# EAGLE design QC_MICRO_v0_1_without_teardrop (EAGLE 5.10)
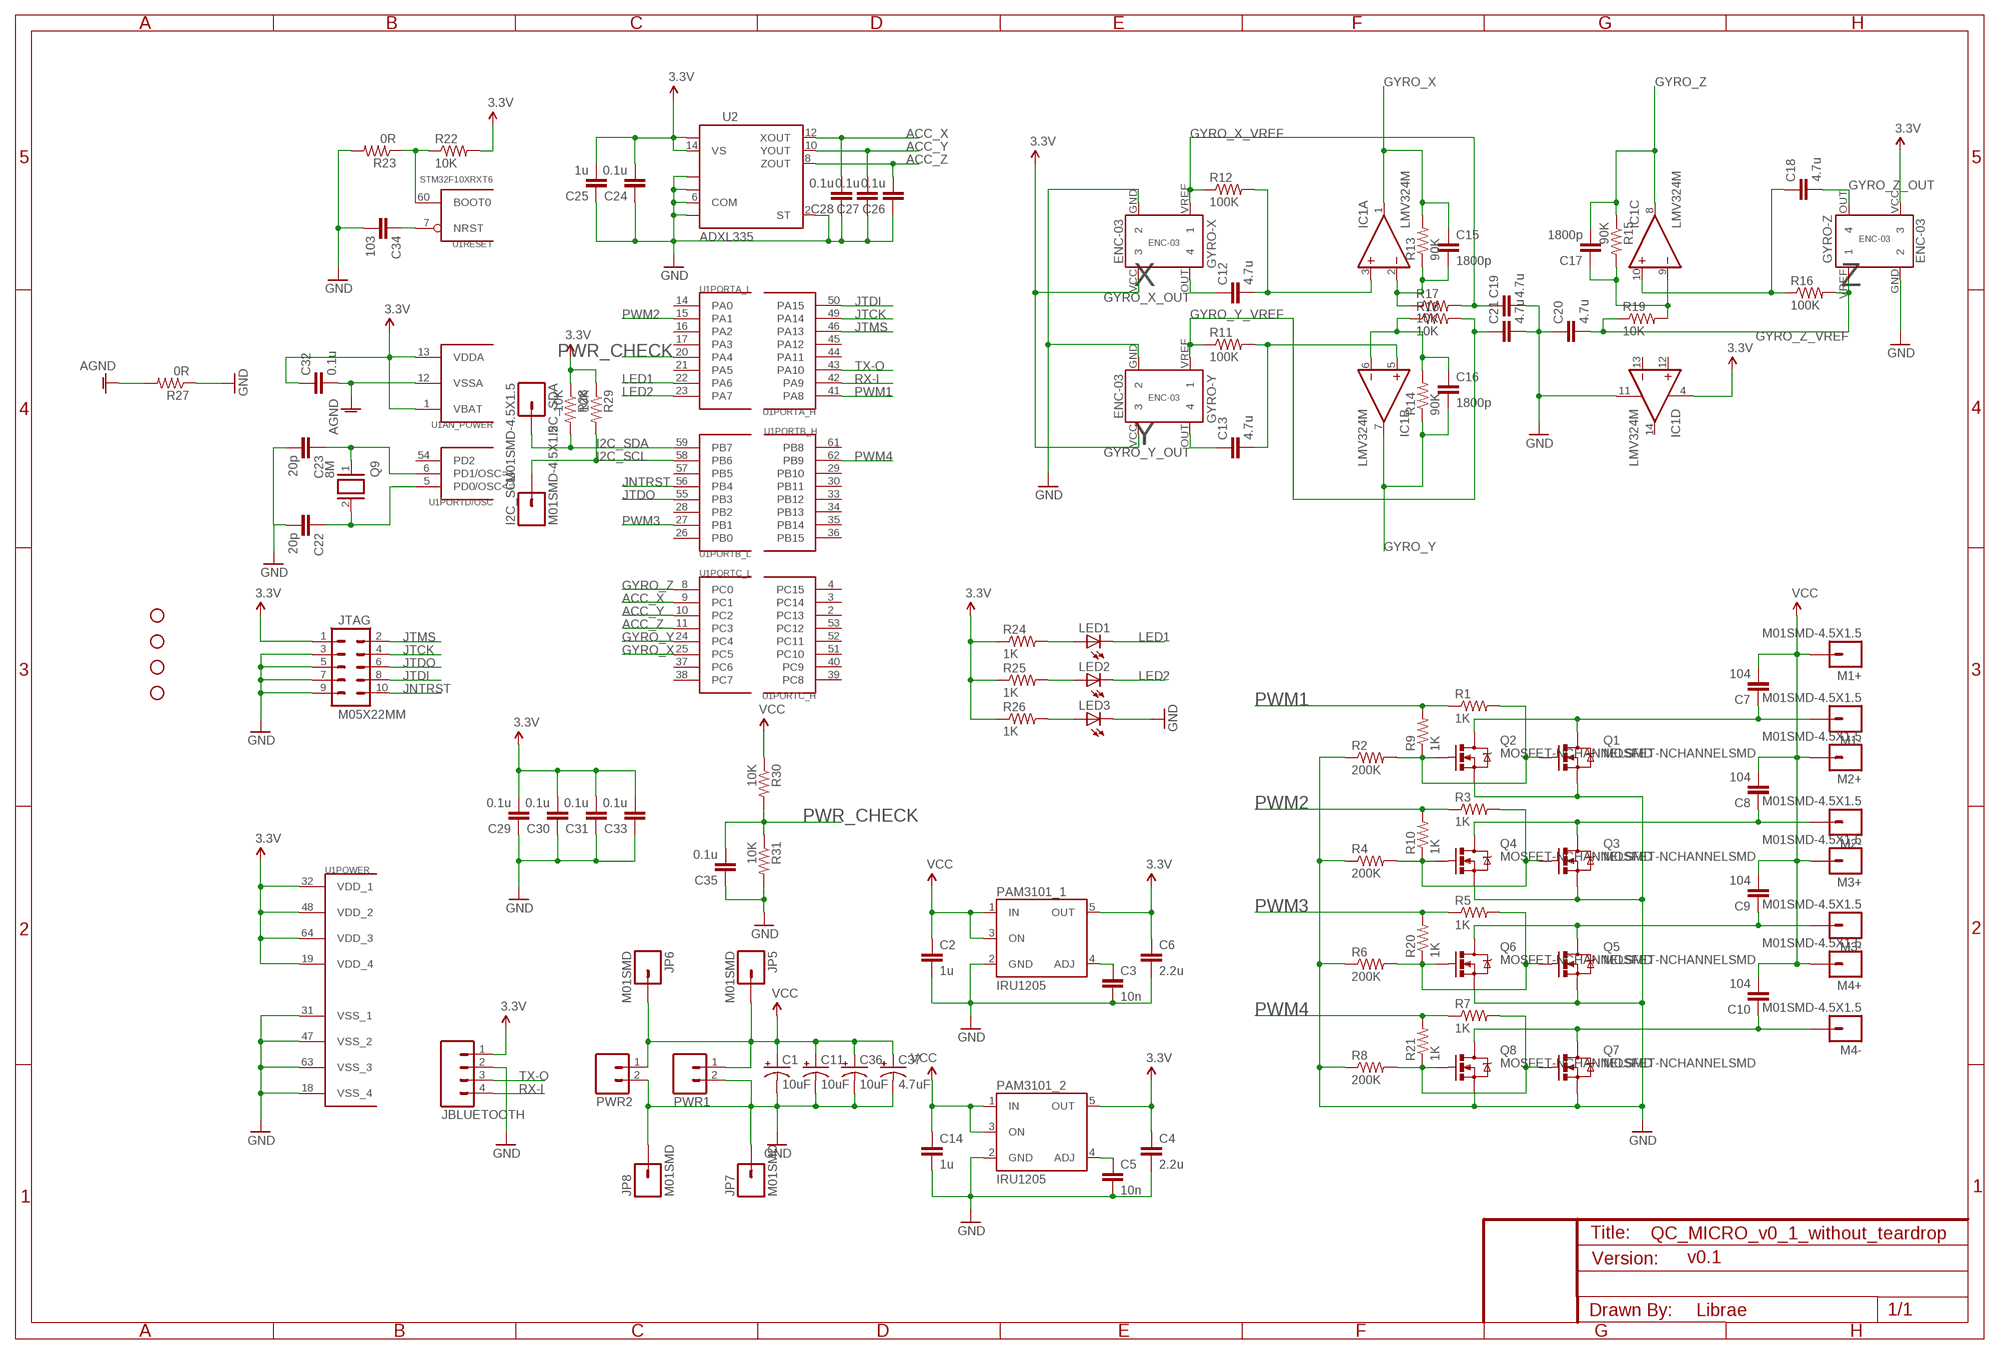
[diagram p0: schematic, sheet 1]

## Parts
C1  10uF  CAP_POL3528  [EIA3528]
C2  1u  CAP0603-CAP  [0603-CAP]
C3  10n  CAP0603-CAP  [0603-CAP]
C4  2.2u  CAP0603-CAP  [0603-CAP]
C5  10n  CAP0603-CAP  [0603-CAP]
C6  2.2u  CAP0603-CAP  [0603-CAP]
C7  104  CAP0603-CAP  [0603-CAP]
C8  104  CAP0603-CAP  [0603-CAP]
C9  104  CAP0603-CAP  [0603-CAP]
C10  104  CAP0603-CAP  [0603-CAP]
C11  10uF  CAP_POL3528  [EIA3528]
C12  4.7u  CAP0603-CAP  [0603-CAP]
C13  4.7u  CAP0603-CAP  [0603-CAP]
C14  1u  CAP0603-CAP  [0603-CAP]
C15  1800p  CAP0603-CAP  [0603-CAP]
C16  1800p  CAP0603-CAP  [0603-CAP]
C17  1800p  CAP0603-CAP  [0603-CAP]
C18  4.7u  CAP0603-CAP  [0603-CAP]
C19  4.7u  CAP0603-CAP  [0603-CAP]
C20  4.7u  CAP0603-CAP  [0603-CAP]
C21  4.7u  CAP0603-CAP  [0603-CAP]
C22  20p  CAP0603-CAP  [0603-CAP]
C23  20p  CAP0603-CAP  [0603-CAP]
C24  0.1u  CAP0603-CAP  [0603-CAP]
C25  1u  CAP0603-CAP  [0603-CAP]
C26  0.1u  CAP0603-CAP  [0603-CAP]
C27  0.1u  CAP0603-CAP  [0603-CAP]
C28  0.1u  CAP0603-CAP  [0603-CAP]
C29  0.1u  CAP0603-CAP  [0603-CAP]
C30  0.1u  CAP0603-CAP  [0603-CAP]
C31  0.1u  CAP0603-CAP  [0603-CAP]
C32  0.1u  CAP0603-CAP  [0603-CAP]
C33  0.1u  CAP0603-CAP  [0603-CAP]
C34  103  CAP0603-CAP  [0603-CAP]
C35  0.1u  CAP0603-CAP  [0603-CAP]
C36  10uF  CAP_POL3528  [EIA3528]
C37  4.7uF  CAP_POL1206  [EIA3216]
GYRO-X  ENC-03S  [ENC-03]
GYRO-Y  ENC-03S  [ENC-03]
GYRO-Z  ENC-03S  [ENC-03]
I2C_SCL  M01SMD-4.5X1.5  [PAD-1.5X4.5]
I2C_SDA  M01SMD-4.5X1.5  [PAD-1.5X4.5]
IC1  LMV324M  [SO14]
JBLUETOOTH  M04SMD  [1X04-SMD]
JP1  STAND-OFF  [STAND-OFF]
JP2  STAND-OFF  [STAND-OFF]
JP3  STAND-OFF  [STAND-OFF]
JP4  STAND-OFF  [STAND-OFF]
JP5  M01SMD  [LUXEON-PAD]
JP6  M01SMD  [LUXEON-PAD]
JP7  M01SMD  [LUXEON-PAD]
JP8  M01SMD  [LUXEON-PAD]
JTAG  M05X22MM  [1X10-2MM]
LED1  LED0603  [LED-0603]
LED2  LED0603  [LED-0603]
LED3  LED0603  [LED-0603]
M1+  M01SMD-4.5X1.5  [PAD-1.5X4.5]
M1-  M01SMD-4.5X1.5  [PAD-1.5X4.5]
M2+  M01SMD-4.5X1.5  [PAD-1.5X4.5]
M2-  M01SMD-4.5X1.5  [PAD-1.5X4.5]
M3+  M01SMD-4.5X1.5  [PAD-1.5X4.5]
M3-  M01SMD-4.5X1.5  [PAD-1.5X4.5]
M4+  M01SMD-4.5X1.5  [PAD-1.5X4.5]
M4-  M01SMD-4.5X1.5  [PAD-1.5X4.5]
PAM3101_1  IRU1205  [SOT23-5]
PAM3101_2  IRU1205  [SOT23-5]
PWR1  M023.5MM  [SCREWTERMINAL-3.5MM-2]
PWR2  M023.5MM  [SCREWTERMINAL-3.5MM-2]
Q1  MOSFET-NCHANNELSMD  [SOT23-3]
Q2  MOSFET-NCHANNELSMD  [SOT23-3]
Q3  MOSFET-NCHANNELSMD  [SOT23-3]
Q4  MOSFET-NCHANNELSMD  [SOT23-3]
Q5  MOSFET-NCHANNELSMD  [SOT23-3]
Q6  MOSFET-NCHANNELSMD  [SOT23-3]
Q7  MOSFET-NCHANNELSMD  [SOT23-3]
Q8  MOSFET-NCHANNELSMD  [SOT23-3]
Q9  8M  XTAL/S  [QS]
R1  1K  RESISTOR0603-RES  [0603-RES]
R2  200K  RESISTOR0603-RES  [0603-RES]
R3  1K  RESISTOR0603-RES  [0603-RES]
R4  200K  RESISTOR0603-RES  [0603-RES]
R5  1K  RESISTOR0603-RES  [0603-RES]
R6  200K  RESISTOR0603-RES  [0603-RES]
R7  1K  RESISTOR0603-RES  [0603-RES]
R8  200K  RESISTOR0603-RES  [0603-RES]
R9  1K  RESISTOR0603-RES  [0603-RES]
R10  1K  RESISTOR0603-RES  [0603-RES]
R11  100K  RESISTOR0603-RES  [0603-RES]
R12  100K  RESISTOR0603-RES  [0603-RES]
R13  90K  RESISTOR0603-RES  [0603-RES]
R14  90K  RESISTOR0603-RES  [0603-RES]
R15  90K  RESISTOR0603-RES  [0603-RES]
R16  100K  RESISTOR0603-RES  [0603-RES]
R17  10K  RESISTOR0603-RES  [0603-RES]
R18  10K  RESISTOR0603-RES  [0603-RES]
R19  10K  RESISTOR0603-RES  [0603-RES]
R20  1K  RESISTOR0603-RES  [0603-RES]
R21  1K  RESISTOR0603-RES  [0603-RES]
R22  10K  RESISTOR0603-RES  [0603-RES]
R23  0R  RESISTOR0603-RES  [0603-RES]
R24  1K  RESISTOR0603-RES  [0603-RES]
R25  1K  RESISTOR0603-RES  [0603-RES]
R26  1K  RESISTOR0603-RES  [0603-RES]
R27  0R  RESISTOR0603-RES  [0603-RES]
R28  10K  RESISTOR0603-RES  [0603-RES]
R29  10K  RESISTOR0603-RES  [0603-RES]
R30  10K  RESISTOR0603-RES  [0603-RES]
R31  10K  RESISTOR0603-RES  [0603-RES]
U1  STM32F10XRXT6  [TQFP64]
U2  ADXL335  [LFCSP-16]

## Nets
3.3V: C4.1 C6.1 C24.2 C25.2 C29.2 C30.2 C31.2 C32.1 C33.2 GYRO-X.VCC GYRO-Y.VCC GYRO-Z.VCC IC1.4(P:V+) JBLUETOOTH.1 JTAG.1 PAM3101_1.5(OUT) PAM3101_2.5(OUT) R22.2 R24.1 R25.1 R26.1 R28.1 R29.1 U1.1(AN_POWER:VBAT) U1.13(AN_POWER:VDDA) U1.19(POWER:VDD_4) U1.32(POWER:VDD_1) U1.48(POWER:VDD_2) U1.64(POWER:VDD_3) U2.14(VS) U2.15(VS)
ACC_X: C28.2 U1.9(PORTC_L:PC1) U2.12(XOUT)
ACC_Y: C27.2 U1.10(PORTC_L:PC2) U2.10(YOUT)
ACC_Z: C26.2 U1.11(PORTC_L:PC3) U2.8(ZOUT)
AGND: C32.2 R27.2 U1.12(AN_POWER:VSSA)
GND: C1.C(-) C2.2 C3.2 C4.2 C5.2 C6.2 C11.C(-) C14.2 C19.2 C20.1 C21.2 C22.2 C23.2 C24.1 C25.1 C26.1 C27.1 C28.1 C29.1 C30.1 C31.1 C33.1 C34.2 C35.1 C36.C(-) C37.C(-) GYRO-X.GND GYRO-Y.GND GYRO-Z.GND IC1.11(P:V-) JBLUETOOTH.2 JP7.P$1 JP8.P$1 JTAG.3 JTAG.5 JTAG.7 JTAG.9 LED3.C PAM3101_1.2(GND) PAM3101_2.2(GND) PWR1.2 PWR2.2 Q1.2(S) Q2.2(S) Q3.2(S) Q4.2(S) Q5.2(S) Q6.2(S) Q7.2(S) Q8.2(S) R2.1 R4.1 R6.1 R8.1 R23.2 R27.1 R31.2 U1.18(POWER:VSS_4) U1.31(POWER:VSS_1) U1.47(POWER:VSS_2) U1.63(POWER:VSS_3) U2.2(ST) U2.3(COM) U2.5(COM) U2.6(COM) U2.7(COM)
GYRO_X: C15.1 IC1.1(A:OUT) R13.2 U1.25(PORTC_L:PC5)
GYRO_X_OUT: C12.1 GYRO-X.OUT
GYRO_X_VREF: C19.1 GYRO-X.VREF R12.1 R17.2
GYRO_Y: C16.2 IC1.7(B:OUT) R14.1 U1.24(PORTC_L:PC4)
GYRO_Y_OUT: C13.1 GYRO-Y.OUT
GYRO_Y_VREF: C21.1 GYRO-Y.VREF R11.1 R18.2
GYRO_Z: C17.2 IC1.8(C:OUT) R15.1 U1.8(PORTC_L:PC0)
GYRO_Z_OUT: C18.2 GYRO-Z.OUT
GYRO_Z_VREF: C20.2 GYRO-Z.VREF R16.2 R19.1
I2C_SCL: I2C_SCL.P$1 R29.2 U1.58(PORTB_L:PB6)
I2C_SDA: I2C_SDA.P$1 R28.2 U1.59(PORTB_L:PB7)
JNTRST: JTAG.10 U1.56(PORTB_L:PB4)
JTCK: JTAG.4 U1.49(PORTA_H:PA14)
JTDI: JTAG.8 U1.50(PORTA_H:PA15)
JTDO: JTAG.6 U1.55(PORTB_L:PB3)
JTMS: JTAG.2 U1.46(PORTA_H:PA13)
LED1: LED1.C U1.22(PORTA_L:PA6)
LED2: LED2.C U1.23(PORTA_L:PA7)
N$1: C7.1 M1-.P$1 Q1.3(D) Q2.3(D)
N$2: C8.1 M2-.P$1 Q3.3(D) Q4.3(D)
N$3: C9.1 M3-.P$1 Q5.3(D) Q6.3(D)
N$4: C10.1 M4-.P$1 Q7.3(D) Q8.3(D)
N$5: Q3.1(G) Q4.1(G) R3.2 R4.2 R10.1
N$6: Q5.1(G) Q6.1(G) R5.2 R6.2 R20.1
N$7: Q7.1(G) Q8.1(G) R7.2 R8.2 R21.1
N$8: Q1.1(G) Q2.1(G) R1.2 R2.2 R9.1
N$9: C3.1 PAM3101_1.4(ADJ)
N$10: C23.1 Q9.1 U1.6(PORTD/OSC:PD1/OSC=>)
N$11: C34.1 U1.7(RESET:NRST)
N$12: R22.1 R23.1 U1.60(RESET:BOOT0)
N$13: LED1.A R24.2
N$14: C5.1 PAM3101_2.4(ADJ)
N$15: C22.1 Q9.2 U1.5(PORTD/OSC:PD0/OSC<=)
N$16: LED2.A R25.2
N$17: LED3.A R26.2
N$18: C13.2 IC1.5(B:+IN) R11.2
N$19: C12.2 IC1.3(A:+IN) R12.2
N$21: C15.2 IC1.2(A:-IN) R13.1 R17.1
N$22: C16.1 IC1.6(B:-IN) R14.2 R18.1
N$24: C17.1 IC1.9(C:-IN) R15.2 R19.2
N$30: C18.1 IC1.10(C:+IN) R16.1
PWM1: R1.1 R9.2 U1.41(PORTA_H:PA8)
PWM2: R3.1 R10.2 U1.15(PORTA_L:PA1)
PWM3: R5.1 R20.2 U1.27(PORTB_L:PB1)
PWM4: R7.1 R21.2 U1.62(PORTB_H:PB9)
PWR_CHECK: C35.2 R30.2 R31.1 U1.20(PORTA_L:PA4)
RX-I: JBLUETOOTH.4 U1.42(PORTA_H:PA9)
TX-O: JBLUETOOTH.3 U1.43(PORTA_H:PA10)
VCC: C1.A(+) C2.1 C7.2 C8.2 C9.2 C10.2 C11.A(+) C14.1 C36.A(+) C37.A(+) JP5.P$1 JP6.P$1 M1+.P$1 M2+.P$1 M3+.P$1 M4+.P$1 PAM3101_1.1(IN) PAM3101_1.3(ON) PAM3101_2.1(IN) PAM3101_2.3(ON) PWR1.1 PWR2.1 R30.1
Unconnected: IC1.12(D:+IN) IC1.13(D:-IN) IC1.14(D:OUT) U1.2(PORTC_H:PC13) U1.3(PORTC_H:PC14) U1.4(PORTC_H:PC15) U1.14(PORTA_L:PA0) U1.16(PORTA_L:PA2) U1.17(PORTA_L:PA3) U1.21(PORTA_L:PA5) U1.26(PORTB_L:PB0) U1.28(PORTB_L:PB2) U1.29(PORTB_H:PB10) U1.30(PORTB_H:PB11) U1.33(PORTB_H:PB12) U1.34(PORTB_H:PB13) U1.35(PORTB_H:PB14) U1.36(PORTB_H:PB15) U1.37(PORTC_L:PC6) U1.38(PORTC_L:PC7) U1.39(PORTC_H:PC8) U1.40(PORTC_H:PC9) U1.44(PORTA_H:PA11) U1.45(PORTA_H:PA12) U1.51(PORTC_H:PC10) U1.52(PORTC_H:PC11) U1.53(PORTC_H:PC12) U1.54(PORTD/OSC:PD2) U1.57(PORTB_L:PB5) U1.61(PORTB_H:PB8)

## Notes on the sheet
- X | Z
- Y
- v0.1
- Librae

## Library data of the parts
C1 C11 C36 C37 = SparkFun:CAP_POL: Capacitor Polarized These are standard SMD and PTH capacitors. Normally 10uF, 47uF, and 100uF in electrolytic and tantalum varieties. Always verify the external diameter of the through hole cap, it varies with capacity, voltage, and manufacturer. The EIA devices should be standard.
C2-C10 C12-C35 = SparkFun:CAP: Capacitor Standard 0603 ceramic capacitor, and 0.1" leaded capacitor.
GYRO-X GYRO-Y GYRO-Z = ENC-03R:ENC-03: ENC-03<2>
I2C_SCL I2C_SDA JP5-JP8 M1+ M1- M2+ M2- M3+ M3- M4+ M4- = SparkFun:M01: Header 1 Standard 1-pin 0.1" header. Use with straight break away headers (SKU : PRT-00116), right angle break away headers (PRT-00553), swiss pins (PRT-00743), machine pins (PRT-00117), and female headers (PRT-00115).
IC1 = linear:LMV324?*: Quad General Purpose, Low Voltage, Rail-to-Rail Output Operational Amplifiers Source: http://www.national.com/mpf/LM/LMV321.html http://www.national.com/dt/lmv_qual.pdf
JBLUETOOTH = MyLib:M04: Header 4 Standard 4-pin 0.1" header. Use with straight break away headers (SKU : PRT-00116), right angle break away headers (PRT-00553), swiss pins (PRT-00743), machine pins (PRT-00117), and female headers (PRT-00115). Molex polarized connector foot print use with SKU : PRT-08231 with associated crimp pins and housings.
JP1-JP4 = SparkFun:STAND-OFF: Stand Off This is the mechanical footprint for a #4 phillips button head screw. Use the keepout ring to avoid running the screw head into surrounding components. SKU : PRT-00447
JTAG = MyLib:M05X2: Header 5x2 Standard 10-pin dual row 0.1" header. Commonly used with AVR-ISP. Use with Spark Fun Electronics SKU: PRT-00778
LED1-LED3 = SparkFun:LED: LEDs Standard schematic elements and footprints for 5mm, 3mm, 1206, and 0603 sized LEDs. 5mm - Spark Fun Electronics SKU : COM-00529 (and others)
PAM3101_1 PAM3101_2 = v-reg-3:IRU1205: Ultra low dropout positive regulator, 300mA, enable input
PWR1 PWR2 = SparkFun:M02: Header 2 Standard 2-pin 0.1" header. Use with straight break away headers (SKU : PRT-00116), right angle break away headers (PRT-00553), swiss pins (PRT-00743), machine pins (PRT-00117), and female headers (PRT-00115). Molex polarized connector foot print use with SKU : PRT-08233 with associated crimp pins and housings.
Q1-Q8 = SparkFun:MOSFET-NCHANNEL
Q9 = special:XTAL/S: CRYSTAL
R1-R31 = SparkFun:RESISTOR: Resistor Basic schematic elements and footprints for 0603, 1206, and PTH 1/10th watt (small) resistors.
U1 = stm32:STM32F10XRXT6: STM32F101/103 64pin LQFP
U2 = SparkFun:ADXL335

## Board
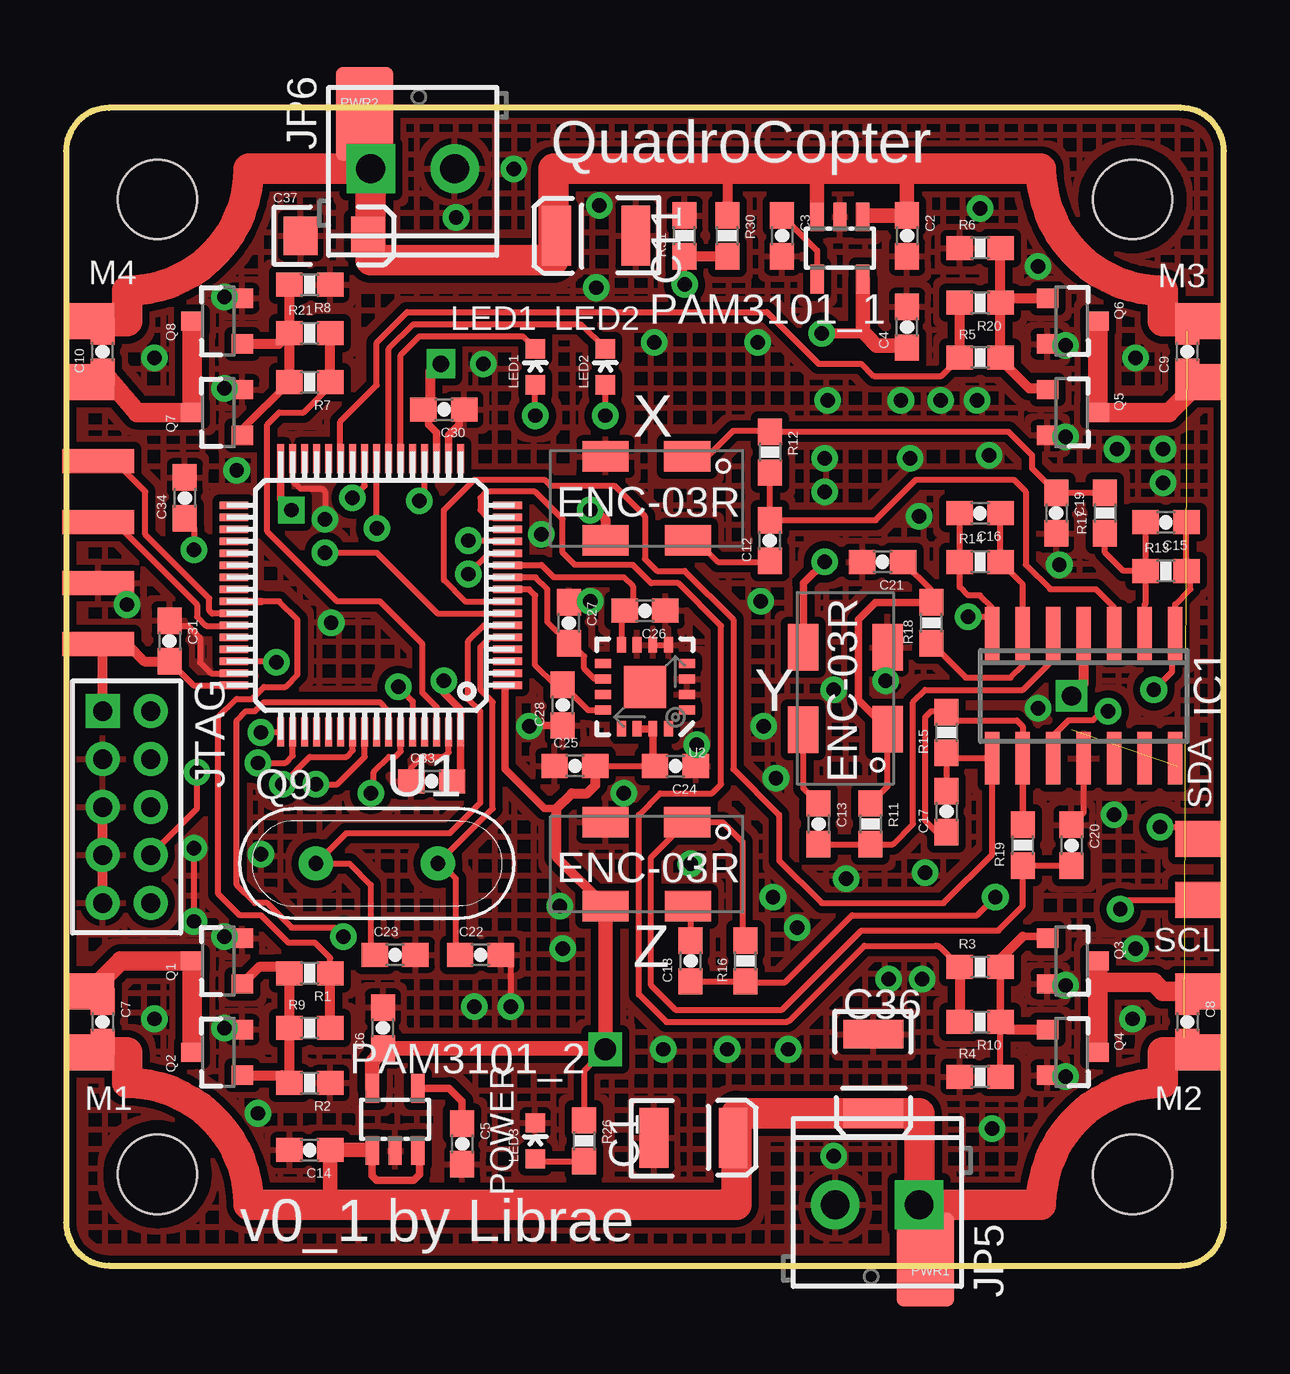
[diagram p1: board, top side]
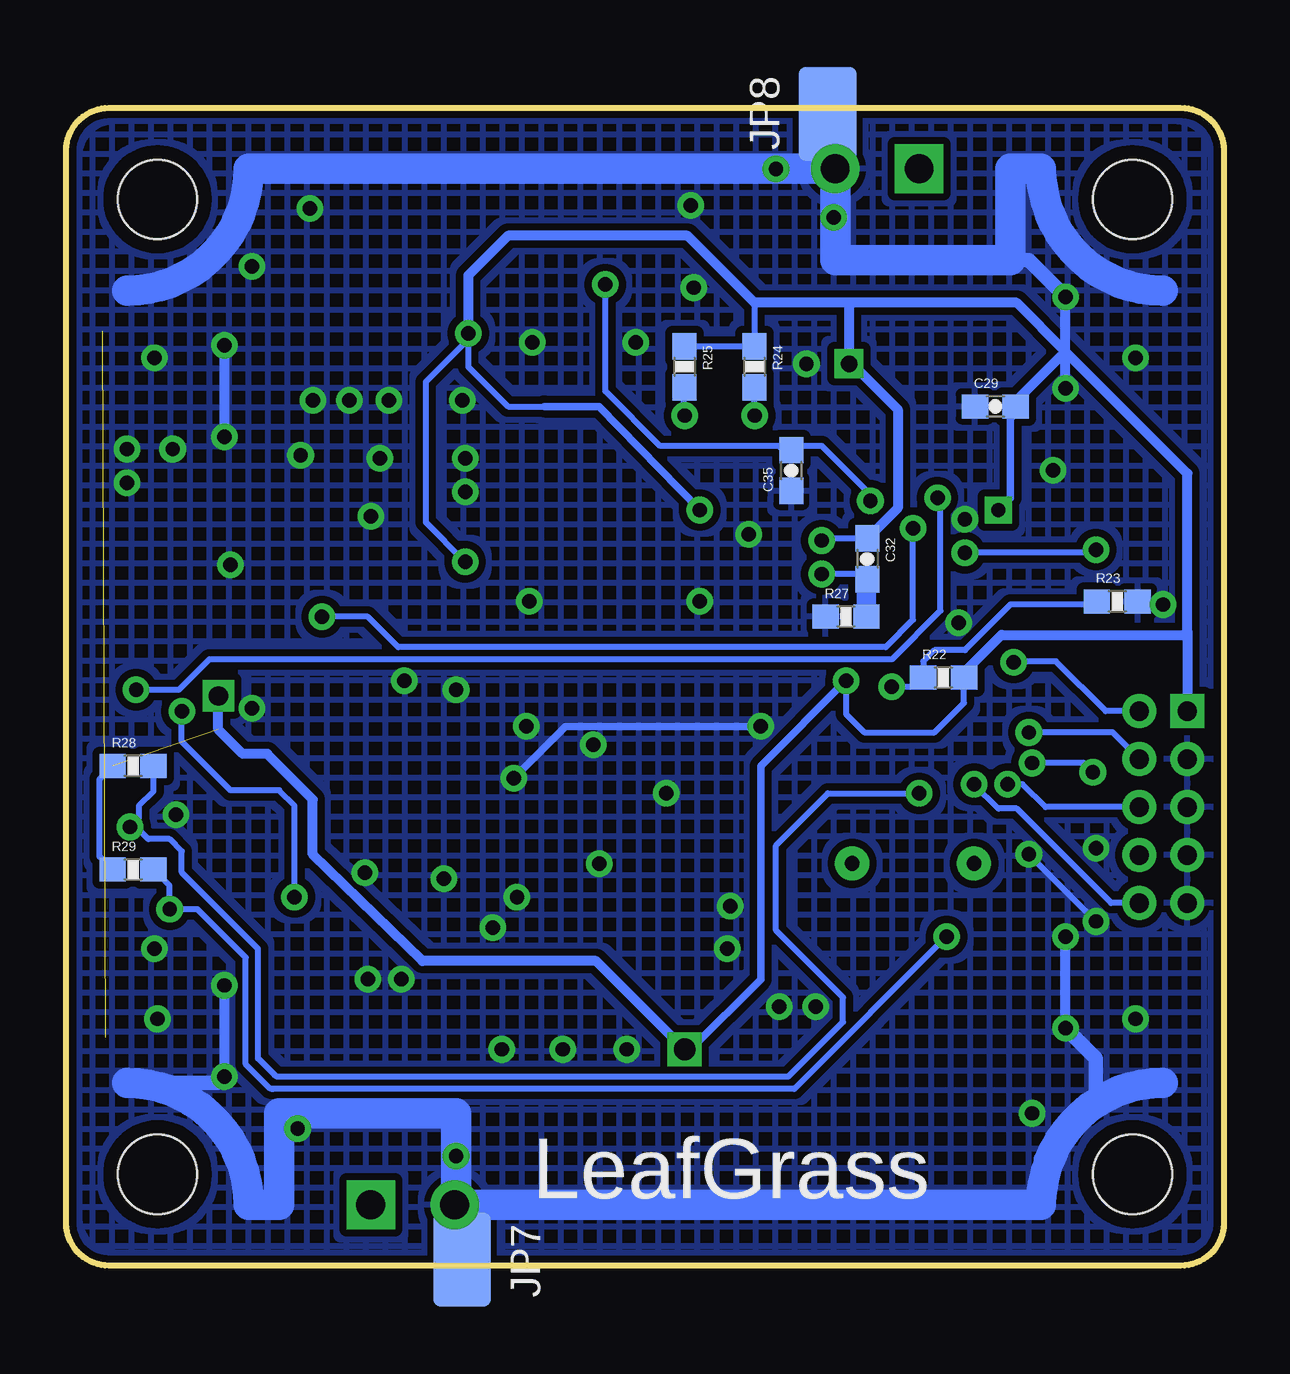
[diagram p2: board, bottom side, seen from below]

Size 48.26 x 48.26 mm. Coordinates in mm from the lower left corner, seen from the top.
Outline: 48.26,46.46 arc90 46.46,48.26 1.8,48.26 arc90 0,46.46 0,1.8 arc90 1.8,0 46.46,0 arc90 48.26,1.8 48.26,46.46
Copper layers (1*16): Top 0.035mm / dielectric 1.5mm / Bottom 0.035mm
Design rules "SparkFun": minimum track width 8mil, minimum drill 20mil, track to track 8mil, track to pad 8mil, pad to pad 8mil, via to via 8mil, smd to smd 8mil, copper to edge 10mil, drill to drill 8mil, minimum pad ring 12mil, minimum via ring 10mil, stop-mask expansion 4mil, vias tented up to drill 25mil, thermal gap 10mil

### Footprints (pad centres in the part's own frame; a part is rotated, then mirrored left to right if it is on the bottom)
EIA3528 = smd 1.2 x 2.5: A 1.65,0; C -1.65,0
0603-CAP = smd 1.1 x 1: 1 -0.85,0; 2 0.85,0
EIA3216 = smd 1.4 x 1.6: A 1.4,0; C -1.4,0
ENC-03 = smd 1.93 x 1.27: GND 1.645,-1.984; OUT -1.791,1.525; VCC 1.645,1.525; VREF -1.765,-1.98
PAD-1.5X4.5 = smd 1.5 x 2: P$1 0,0
SO14 = smd 0.6 x 2.2: 1 -3.81,-2.6; 2 -2.54,-2.6; 3 -1.27,-2.6; 4 0,-2.6; 5 1.27,-2.6; 6 2.54,-2.6; 7 3.81,-2.6; 8 3.81,2.6; 9 2.54,2.6; 10 1.27,2.6; 11 0,2.6; 12 -1.27,2.6; 13 -2.54,2.6; 14 -3.81,2.6
1X04-SMD = smd 1 x 3: 1 -3.81,-0.08; 2 -1.27,-0.08; 3 1.27,-0.08; 4 3.81,-0.08
STAND-OFF = hole 3.302: 0,0
LUXEON-PAD = smd 3.9 x 2.4: P$1 0,0
1X10-2MM = drill 0.8 square: 1 0,0 | drill 0.8 round: 2 0,2; 3 2,0; 4 2,2; 5 4,0; 6 4,2; 7 6,0; 8 6,2; 9 8,0; 10 8,2
LED-0603 = smd 0.8 x 0.8: A 0,-0.75; C 0,0.75
SOT23-5 = smd 0.55 x 1.2: 1 -0.95,-1.3; 2 0,-1.3; 3 0.95,-1.3; 4 0.95,1.3; 5 -0.95,1.3
SCREWTERMINAL-3.5MM-2 = drill 1.2 pad 2.032 square: 1 0,0 | drill 1.2 pad 2.032 round: 2 3.5,0
SOT23-3 = smd 0.8 x 0.9: 1 -0.95,-1; 2 0.95,-1; 3 0,1.1
QS = drill 0.61 pad 1.422 round: 1 -2.54,0; 2 2.54,0
0603-RES = smd 1.1 x 1: 1 -0.85,0; 2 0.85,0
TQFP64 = smd 1.2 x 0.3: 1 -5.7,3.75; 2 -5.7,3.25; 3 -5.7,2.75; 4 -5.7,2.25; 5 -5.7,1.75; 6 -5.7,1.25; 7 -5.7,0.75; 8 -5.7,0.25; 9 -5.7,-0.25; 10 -5.7,-0.75; 11 -5.7,-1.25; 12 -5.7,-1.75; 13 -5.7,-2.25; 14 -5.7,-2.75; 15 -5.7,-3.25; 16 -5.7,-3.75; 33 5.7,-3.75; 34 5.7,-3.25; 35 5.7,-2.75; 36 5.7,-2.25; 37 5.7,-1.75; 38 5.7,-1.25; 39 5.7,-0.75; 40 5.7,-0.25; 41 5.7,0.25; 42 5.7,0.75; 43 5.7,1.25; 44 5.7,1.75; 45 5.7,2.25; 46 5.7,2.75; 47 5.7,3.25; 48 5.7,3.75 | smd 0.3 x 1.2: 17 -3.75,-5.7; 18 -3.25,-5.7; 19 -2.75,-5.7; 20 -2.25,-5.7; 21 -1.75,-5.7; 22 -1.25,-5.7; 23 -0.75,-5.7; 24 -0.25,-5.7; 25 0.25,-5.7; 26 0.75,-5.7; 27 1.25,-5.7; 28 1.75,-5.7; 29 2.25,-5.7; 30 2.75,-5.7; 31 3.25,-5.7; 32 3.75,-5.7; 49 3.75,5.7; 50 3.25,5.7; 51 2.75,5.7; 52 2.25,5.7; 53 1.75,5.7; 54 1.25,5.7; 55 0.75,5.7; 56 0.25,5.7; 57 -0.25,5.7; 58 -0.75,5.7; 59 -1.25,5.7; 60 -1.75,5.7; 61 -2.25,5.7; 62 -2.75,5.7; 63 -3.25,5.7; 64 -3.75,5.7
LFCSP-16 = smd 1.75 x 1.75: 0 0,0 | smd 0.65 x 0.37: 1 -1.75,0.975; 2 -1.75,0.325; 3 -1.75,-0.325; 4 -1.75,-0.975; 9 1.75,-0.975; 10 1.75,-0.325; 11 1.75,0.325; 12 1.75,0.975 | smd 0.37 x 0.65: 5 -0.975,-1.75; 6 -0.325,-1.75; 7 0.325,-1.75; 8 0.975,-1.75; 13 0.975,1.75; 14 0.325,1.75; 15 -0.325,1.75; 16 -0.975,1.75

### Placement (x,y rotation side)
C1  26.16,5.33 0 top
C2  35.05,42.93 270 top
C3  29.84,42.93 270 top
C4  35.05,39.12 90 top
C5  16.51,5.08 270 top
C6  13.21,9.91 90 top
C7  1.52,10.16 270 top
C8  46.74,10.16 270 top
C9  46.74,38.1 90 top
C10  1.52,38.1 90 top
C11  22.1,42.93 180 top
C12  29.34,30.23 90 top
C13  31.37,18.41 270 top
C14  10.16,4.83 180 top
C15  45.85,30.99 180 top
C16  38.1,31.37 180 top
C17  36.7,18.92 90 top
C18  26.04,12.7 90 top
C19  41.27,31.37 270 top
C20  41.91,17.53 270 top
C21  34.04,29.34 180 top
C22  17.27,12.95 0 top
C23  13.72,12.95 0 top
C24  25.4,20.83 180 top
C25  21.21,20.83 0 top
C26  24.13,27.3 180 top
C27  20.95,26.8 270 top
C28  20.7,23.37 90 top
C29  9.53,35.81 0 bottom
C30  15.75,35.69 180 top
C31  4.32,26.04 270 top
C32  14.86,29.46 270 bottom
C33  15.24,20.19 0 top
C34  4.95,32 90 top
C35  18.03,33.15 90 bottom
C36  33.66,8 270 top
C37  11.18,42.93 0 top
GYRO-X  24.13,31.75 180 top
GYRO-Y  32.26,24.13 90 top
GYRO-Z  24.13,16.51 180 top
I2C_SCL  47.24,15.24 90 top
I2C_SDA  47.24,17.78 90 top
IC1  42.42,23.75 180 top
JBLUETOOTH  1.27,29.72 90 top
JP1  3.81,3.81 0 top
JP2  44.45,3.81 0 top
JP3  44.45,44.45 0 top
JP4  3.81,44.45 0 top
JP5  35.81,0.25 270 top
JP6  12.45,48.01 90 top
JP7  31.75,0.25 270 bottom
JP8  16.51,48.01 90 bottom
JTAG  1.52,23.11 270 top
LED1  19.56,37.47 0 top
LED2  22.48,37.47 0 top
LED3  19.56,5.21 0 top
M1+  1.02,8.89 90 top
M1-  1.02,11.43 90 top
M2+  47.24,8.89 90 top
M2-  47.24,11.43 90 top
M3+  47.24,39.37 90 top
M3-  47.24,36.83 90 top
M4+  1.02,39.37 90 top
M4-  1.02,36.83 270 top
PAM3101_1  32.26,42.42 180 top
PAM3101_2  13.72,6.1 0 top
PWR1  35.56,2.54 180 top
PWR2  12.7,45.72 0 top
Q1  6.35,12.7 90 top
Q2  6.35,8.89 90 top
Q3  41.91,12.7 270 top
Q4  41.91,8.89 270 top
Q5  41.91,35.56 270 top
Q6  41.91,39.37 270 top
Q7  6.35,35.56 90 top
Q8  6.35,39.37 90 top
Q9  12.95,16.76 0 top
R1  10.16,12.19 180 top
R2  10.16,7.62 180 top
R3  38.1,12.45 0 top
R4  38.1,7.87 0 top
R5  38.1,37.85 0 top
R6  38.1,42.42 0 top
R7  10.16,36.83 180 top
R8  10.16,40.89 180 top
R9  10.16,9.91 0 top
R10  38.1,10.16 180 top
R11  33.53,18.41 270 top
R12  29.34,33.91 270 top
R13  45.85,28.96 0 top
R14  38.1,29.34 0 top
R15  36.7,22.23 90 top
R16  28.32,12.7 90 top
R17  43.31,31.37 90 top
R18  36.07,26.8 90 top
R19  39.88,17.53 90 top
R20  38.1,40.13 180 top
R21  10.16,38.86 0 top
R22  11.68,24.51 0 bottom
R23  4.45,27.69 0 bottom
R24  19.56,37.47 270 bottom
R25  22.48,37.47 270 bottom
R26  21.59,5.21 270 top
R27  15.75,27.05 0 bottom
R28  45.47,20.83 0 bottom
R29  45.47,16.51 0 bottom
R30  27.56,42.93 270 top
R31  25.78,42.93 90 top
U1  12.7,27.94 180 top
U2  24.13,24.13 180 top

### Tracks (layer width: path | path; a pad name or v marks a point on that pad's centre or on a via)
3.3V  (via drill 0.6, 0.7, 0.8, 0.9)  (1 unrouted)
  Top 0.254: C25.2 C24.2 | C30.2 15.11,35.47 | U1.48 5.31,24.19 C31.2 | C33.2 16.45,20.19 U1.64 | R26.1 21.59,8.13 v22.48,9.02 | v16.76,30.23 18.36,30.23 U1.13
  Top 0.305: C24.2 24.45,20.92 U2.15 U2.14 | U1.19 15.45,34.72 15.11,35.05 15.11,35.47 | 22.44,9.06 v22.48,9.02 | 22.48,14.98 GYRO-Z.VCC | 20.45,19.05 19.94,19.05 18.29,20.7 18.29,24.08 U1.1 | 16.45,20.19 16.45,23.17 15.75,23.88 v15.75,24.38 | U1.32 8.95,31.94 v9.4,31.5 | GYRO-Y.VCC 30.73,28.45 v31.62,29.34 | 22.48,31.11 22.1,31.5 v21.84,31.5
  Top 0.406: v31.5,38.86 33.27,38.86 33.4,38.73 | JTAG.1 1.52,25.73 JBLUETOOTH.1 2.54,25.91 3.26,25.18 C31.2 | GYRO-Z.VCC 20.45,17.02 20.45,19.05 21.08,19.68 21.72,19.68 22.06,20.03 C25.2 | 22.48,31.11 GYRO-X.VCC | C30.2 15.18,35.97 15.18,37.27 15.49,37.59 v15.62,37.59 | IC1.4 42.42,24.26 v41.91,23.75
  Top 0.61: PAM3101_2.5 12.77,8.48 C6.1 22.44,9.06 | PAM3101_1.5 33.21,38.93 33.4,38.73 33.78,38.35 34.96,38.35 C4.1 | v22.48,9.02 22.48,14.98
  Bottom 0.254: R22.2 10.83,23.46 12.06,22.23 14.99,22.23 15.75,22.99 v15.75,24.38 | R25.1 R24.1 19.56,40.13 | v31.62,29.34 33.27,30.99 33.27,36.83 31.5,38.61 v31.5,38.86 31.5,37.47 29.84,35.81 28.32,35.81 | v16.76,30.23 16.68,30.31 C32.1 | R29.1 46.86,17.06 46.86,20.28 R28.1
  Bottom 0.305: v15.75,24.38 19.3,20.83 19.3,11.94 22.23,9.02 v22.48,9.02 | v9.4,31.5 8.89,32 8.89,35.31 8.68,35.52 C29.2 | v31.5,38.86 31.62,38.73 | v21.84,31.5 26.04,35.81 28.32,35.81
  Bottom 0.406: 1.52,26.42 JTAG.1 | 1.52,26.42 1.52,33.02 6.6,38.1 | 6.6,38.1 8.64,40.13 15.62,40.13 | 15.62,40.13 19.56,40.13 22.35,42.93 29.84,42.93 31.5,41.27 v31.5,38.86 | 15.62,40.13 v15.62,37.59 15.49,37.59 13.59,35.69 13.59,31.58 C32.1 | C29.2 8.68,36.03 6.6,38.1 | R22.2 10.83,24.73 9.27,26.29 1.65,26.29 1.52,26.42 | v41.91,23.75 41.91,22.35 40.89,21.34 39.88,21.34 37.97,19.43 37.97,17.14 33.4,12.7 26.16,12.7 v22.48,9.02
ACC_X
  Top 0.254: U1.9 19.31,28.19 19.56,27.94 19.56,25.02 20.36,24.22 C28.2 21.76,23.16 U2.12
ACC_Y
  Top 0.254: U2.10 22.03,24.45 21.59,24.89 21.59,25.4 21.04,25.95 C27.2 20.07,26.84 20.07,28.19 19.57,28.69 U1.10
ACC_Z
  Top 0.254: C26.2 23.11,27.3 | U1.11 18.42,29.21 19.81,29.21 20.32,28.7 23.24,28.7 23.62,28.32 23.62,27.77 C26.2 | U2.8 23.15,27.18 C26.2
  Top 0.305: U2.8
AGND  (via drill 0.6)
  Top 0.254: v16.76,28.83 17.62,29.69 U1.12
  Bottom 0.254: C32.2 15.07,28.83 v16.76,28.83
  Bottom 0.406: 14.9,28.57 C32.2
  Bottom 0.813: R27.2 14.9,28.57
GND  (via drill 0.6)
  Top 0.254: 16.38,35.47 C30.1 | U1.47 6.04,24.69 5.59,25.15 5.59,26.16 5.08,26.67 4.53,26.67 C31.1 | C20.1 42.42,18.88 IC1.11 | C33.1 14.39,20.74 14.86,21.21 15.75,21.21 15.95,21.41 U1.63 | U1.31 9.45,32.71 9.78,32.38 10.67,32.38 10.79,32.26 v10.79,31.11 | v5.33,14.35 v5.33,17.4 | U2.6 U2.5 | C22.2 18.54,12.95 v18.54,10.79
  Top 0.305: U1.18 15.95,34.62 16.38,35.05 16.38,35.47 | C28.1 19.34,22.52 v19.3,22.48
  Top 0.406: 7.35,9.91 Q2.2 6.67,9.84 v6.6,9.91 | v6.6,13.72 6.67,13.65 Q1.2 | Q4.2 41.66,7.94 v41.66,7.87 | Q3.2 41.66,11.75 v41.66,11.68 | Q7.2 6.6,36.51 v6.6,36.58 | Q8.2 6.6,40.32 v6.6,40.39 | Q6.2 41.66,38.42 v41.66,38.35 | JTAG.9 JTAG.5
  Bottom 0.254: v5.33,14.35 v8.13,17.14
  Bottom 0.305: v19.3,22.48 27.43,22.48 v29.59,20.32
  Bottom 0.406: PWR2.2 16.51,45.72 JP8.P$1 | JP7.P$1 32.06,0.25 PWR1.2 | 41.66,7.94 v41.66,11.68 | v6.6,9.91 v6.6,13.72 | v6.6,36.58 v6.6,40.39 | v41.66,34.54 v41.66,38.35
  Bottom 0.61: 41.66,7.94 v41.66,7.87 41.91,7.62 45.72,7.62 | 7.62,2.54 7.62,4.45 5.33,6.73 5.33,8.64 v6.6,9.91 | 8.89,41.91 8.13,41.91 v6.6,40.39
  Bottom 1.27: 2.54,7.62 arc-90 7.62,2.54 32,2.54 32,6.35 39.37,6.35 39.37,2.54 40.64,2.54 arc-90 45.72,7.62 | 2.54,40.64 arc90 7.62,45.72 8.89,45.72 8.89,41.91 16.2,41.91 PWR2.2 40.64,45.72 arc90 45.72,40.64
  Bottom 1.422: 32,2.54 PWR1.2
  other vias: 3.68,37.85 11.05,26.8 32,24 28.96,27.69 29.46,15.37 35.81,16.38 35.18,33.66 31.62,33.66 31.62,32.26 44.58,37.85 3.68,10.29 44.45,10.29 28.83,38.48 24.51,38.48 40.51,23.24 41.4,29.21 2.54,27.56 17.4,37.59 26.04,16.76 23.24,19.68 20.7,13.21 19.81,30.48 21.84,27.69 22.23,44.2 34.16,24.38 26.29,21.72 24.89,9.02 27.56,9.02 30.1,9.02 44.58,13.21 43.69,18.8 43.81,34.04 45.72,34.04 45.72,32.64 37.97,36.07 36.45,36.07 34.8,36.07 31.75,36.07 20.57,14.99 17.02,10.79 16.26,43.69 18.67,45.72 22.1,40.77 38.48,33.78 30.48,14.1 32.51,16.13 35.69,11.94 34.29,11.94 32,4.57 38.61,5.71 8,6.35 7.11,33.15 38.1,44.07 40.51,41.66 35.56,31.24 29.08,22.48
  pour Top (isolate 0.305, hatched): 0,1.27 0,46.99 arc-90 1.27,48.26 46.99,48.26 arc-90 48.26,46.99 48.26,1.27 arc-90 46.99,0 1.27,0 arc-90
  pour Bottom (isolate 0.305, hatched): 0,1.27 arc90 1.27,0 46.99,0 arc90 48.26,1.27 48.26,46.99 arc90 46.99,48.26 1.27,48.26 arc90 0,46.99
GYRO_X  (via drill 0.6)
  Top 0.254: C15.1 R13.2 46.86,28.79 46.86,28.19 46.23,27.56 IC1.1 46.35,26.48 | U1.25 12.45,32.51 v11.94,32 | 46.1,26.22 46.1,24.77 v45.34,24
  Top 0.305: 46.1,26.22 IC1.1
  Bottom 0.254: v11.94,32 11.81,31.88 11.81,27.3 13.84,25.27 42.29,25.27 43.56,24 v45.34,24
GYRO_X_OUT
  Top 0.254: GYRO-X.OUT 26.29,30.23 27.18,29.34 29.3,29.34 C12.1
GYRO_X_VREF
  Top 0.254: GYRO-X.VREF 26.75,33.73 27.81,34.8 29.3,34.8 R12.1 39.28,34.76 40.26,33.78 40.26,33.23 C19.1 R17.2
GYRO_Y  (via drill 0.6)
  Top 0.254: C16.2 R14.1 37.25,28.28 37.59,27.94 38.1,27.94 38.61,27.43 IC1.7 38.43,26.53 38.43,27.05 v37.59,27.05 | U1.24 v12.95,30.73
  Bottom 0.254: v12.95,30.73 12.95,26.92 14.1,25.78 34.42,25.78 35.69,27.05 v37.59,27.05
GYRO_Y_OUT
  Top 0.254: C13.1 30.73,19.9 GYRO-Y.OUT
GYRO_Y_VREF
  Top 0.254: R11.1 34.24,19.98 GYRO-Y.VREF | R18.2 36.07,28.16 C21.1
  Top 0.305: GYRO-Y.VREF 33.02,23.58 33.02,26.92 33.74,27.65 R18.2
GYRO_Z
  Top 0.254: U1.8 16.63,27.69 15.75,28.57 15.75,31.5 17.02,32.77 19.94,32.77 20.19,32.51 22.86,32.51 24.13,31.24 24.13,29.46 24.64,28.96 25.78,28.96 27.81,26.92 27.81,20.7 29.72,18.8 29.72,16.89 31.5,15.11 36.58,15.11 38.61,17.14 IC1.8 36.93,21.15 R15.1 C17.2
GYRO_Z_OUT
  Top 0.254: C18.2 26.04,14.87 GYRO-Z.OUT
GYRO_Z_VREF
  Top 0.254: R16.2 28.19,13.68 28.19,17.65 27.36,18.49 GYRO-Z.VREF 25.86,18.49 24.38,17.02 24.38,11.68 25.4,10.67 29.84,10.67 33.15,13.97 38.86,13.97 39.88,14.99 R19.1 C20.2
I2C_SCL  (via drill 0.6)
  Top 0.254: U1.58 13.45,23.13 13.08,23.5 8.26,23.5 7.87,23.11 7.49,23.11 7.11,22.73 7.11,15.88 7.87,15.11 8.38,15.11 9.4,14.1 11.18,14.1 v11.56,13.72 | 46.35,15.62 I2C_SCL.P$1 44.32,15.24 v43.94,14.86
  Bottom 0.254: v11.56,13.72 17.91,7.37 39.65,7.37 arc45 39.83,7.44 40.77,8.38 40.77,12.85 42.78,14.86 v43.94,14.86 43.94,15.84 R29.2
I2C_SDA  (via drill 0.6)
  Top 0.254: U1.59 13.95,21.44 13.72,21.21 13.46,21.21 12.83,20.57 12.83,19.81 v12.7,19.68 | v45.59,18.29 46.48,18.29 I2C_SDA.P$1
  Bottom 0.254: v12.7,19.68 16.51,19.68 18.67,17.53 18.67,13.97 15.88,11.18 15.88,10.16 18.16,7.87 39.39,7.87 arc45 39.57,7.95 40.26,8.64 40.26,13.21 43.43,16.38 43.43,17.27 43.94,17.78 44.83,17.78 45.34,18.29 v45.59,18.29 45.21,18.67 45.21,19.18 44.62,19.77 R28.2
JNTRST  (via drill 0.6)
  Top 0.254: v10.41,20.07 11.3,20.07 12.45,21.21 U1.56
  Bottom 0.254: JTAG.10 4.7,15.11 8.64,19.05 9.4,19.05 v10.41,20.07
JTCK  (via drill 0.6)
  Top 0.254: v8.13,22.23 8.14,22.24 U1.49
  Bottom 0.254: JTAG.4 4.63,22.23 v8.13,22.23
JTDI  (via drill 0.6)
  Top 0.254: JTAG.8 5.46,19.05 v5.46,20.57 | v8,20.95 9.14,20.95 9.45,21.26 U1.50
  Bottom 0.254: v5.46,20.57 5.84,20.95 v8,20.95
JTDO  (via drill 0.6)
  Top 0.254: v9.02,20.07 10.16,21.21 11.68,21.21 11.95,21.48 U1.55
  Bottom 0.254: JTAG.6 7.43,19.11 8.38,20.07 v9.02,20.07
JTMS  (via drill 0.6)
  Top 0.254: v8.76,25.15 8.72,25.19 U1.46
  Bottom 0.254: JTAG.2 4.92,23.11 U1.46 8.72,25.19 v8.76,25.15
LED1
  Top 0.254: U1.22 13.95,37.95 14.73,38.73 19.04,38.73 LED1.C
LED2
  Top 0.254: LED2.C 21.45,39.24 14.48,39.24 13.45,38.22 U1.23
N$1
  Top 0.406: M1-.P$1 1.27,11.43 C7.1
  Top 0.813: Q2.3 Q1.3 2.29,12.7 M1-.P$1
N$2
  Top 0.254: 47.24,11.81 47.75,11.3 47.03,11.3 C8.1
  Top 0.406: C8.1 47.24,11.01 M2-.P$1
  Top 0.813: Q4.3 43.01,11.81 | 43.01,11.81 Q3.3 | 43.01,11.81 45.34,11.81 45.72,11.43 M2-.P$1
N$3
  Top 0.813: C9.1 46.99,37.08 M3-.P$1 45.97,35.56 Q5.3 Q6.3
N$4
  Top 0.813: M4-.P$1 1.27,37.08 C10.1 2.96,35.56 Q7.3 Q8.3
N$5
  Top 0.254: R4.2 R10.1
  Top 0.305: 39.88,13.72 40.84,13.72 Q3.1 | R10.1 R3.2
  Top 0.406: R3.2 38.95,12.79 39.88,13.72 | Q4.1 39.27,9.84 R10.1
N$6
  Top 0.406: Q5.1 40.84,36.58 40.13,36.58 38.95,37.76 R5.2 R20.1 39.14,40.32 | 39.14,40.32 Q6.1 | 39.14,40.32 38.95,40.51 R6.2
N$7
  Top 0.305: Q7.1 7.35,34.87 R7.2
  Top 0.406: R21.1 8.87,38.42 Q8.1 | R7.2 R21.1 | R21.1 R8.2
N$8
  Top 0.406: Q1.1 8.05,12.45 9.31,12.45 R1.2 R9.1 R2.2 8.99,7.94 Q2.1
N$9
  Top 0.254: PAM3101_1.4 31.31,42.31 C3.1
N$10
  Top 0.254: U1.6 17.42,26.69 16.76,26.04 16.76,23.62 17.27,23.11 17.27,19.3 16,18.03 11.68,18.03 Q9.1 11.81,16.76 12.7,15.88 12.7,13.12 C23.1
N$11  (via drill 0.6)
  Top 0.254: U1.7 15.48,27.19 12.95,29.72 v10.79,29.72 | v5.33,29.84 5.33,30.77 C34.1
  Bottom 0.254: v10.79,29.72 5.46,29.72 v5.33,29.84
N$12  (via drill 0.6)
  Top 0.254: U1.60 14.45,23.52 v13.84,24.13
  Bottom 0.254: v13.84,24.13 12.91,24.13 R22.1 12.53,25.18 12.06,25.65 10.79,25.65 8.89,27.56 5.42,27.56 R23.1
N$13  (via drill 0.6)
  Top 0.254: v19.56,35.43 LED1.A
  Bottom 0.254: v19.56,35.43 R24.2
N$14
  Top 0.305: PAM3101_2.4 15.97,7.4 16.51,6.86 C5.1
N$15
  Top 0.254: U1.5 17.68,26.19 17.27,25.78 17.27,24 17.78,23.5 17.78,19.05 Q9.2 15.62,16.76 16.26,16.13 16.26,13.12 C22.1
N$16  (via drill 0.6)
  Top 0.254: v22.48,35.43 22.49,36.58 LED2.A
  Bottom 0.254: R25.2 22.52,36.58 v22.48,35.43
N$17
  Top 0.254: R26.2 19.66,4.36 LED3.A
N$18
  Top 0.254: C13.2 R11.2 34.46,17.57 35.31,18.41 35.31,23.5 35.81,24 39.88,24 41.15,25.27 IC1.5
N$19
  Top 0.254: R12.2 C12.2 33.74,31.08 35.43,32.77 39.5,32.77 40.01,32.26 40.01,29.21 41.02,28.19 42.93,28.19 43.69,27.43 IC1.3
N$21
  Top 0.254: R13.1 C15.2 | 44.83,26.48 IC1.2 44.96,27.56 45,27.6 R13.1 | R17.1 43.31,29.72 44.07,28.96 R13.1
N$22
  Top 0.254: R14.2 C16.1 | R14.2 39.12,29.17 | R14.2 39.88,28.41 IC1.6 39.88,25.02 39.37,24.51 37.5,24.51 R18.1
N$24
  Top 0.254: C17.1 36.28,18.07 35.81,18.54 35.81,22.86 36.07,23.11 36.66,23.11 R15.2 37.05,22.73 39.62,22.73 39.88,22.48 R19.2 IC1.9
N$30  (via drill 0.6)
  Top 0.254: C18.1 R16.1 28.36,11.81 29.97,11.81 32.77,14.61 37.97,14.61 v38.73,15.37 | 41.02,21.72 41.15,21.59 IC1.10 41.15,22.1 41.78,22.73 42.8,22.73 43.18,23.11 v43.43,23.11
  Bottom 0.254: v38.73,15.37 38.73,19.18 39.37,19.81 41.4,19.81 43.43,21.84 v43.43,23.11
PWM1
  Top 0.254: R1.1 11.01,12.83 10.38,13.46 9.27,13.46 8.13,14.61 7.24,14.61 6.35,15.49 6.35,22.86 7.11,23.62 7.75,23.62 8.26,24.13 9.14,24.13 9.65,24.64 9.65,26.92 8.89,27.69 8.13,27.69
  Top 0.305: 8.13,27.69 U1.41
  Top 0.406: R9.2 R1.1
PWM2
  Top 0.254: U1.15 17.58,31.19 17.27,31.5 17.27,32 17.53,32.26 19.56,32.26 20.7,31.11 20.7,29.72 21.21,29.21 23.62,29.21 24.38,28.45 25.53,28.45 27.3,26.67 27.3,20.07 26.92,19.68 24.77,19.68 23.88,18.8 23.88,11.3 25.02,10.16 29.99,10.16 arc45 30.17,10.23 33.27,13.34 36.26,13.34 arc-45 36.44,13.26 R3.1
  Top 0.406: R3.1 R10.2
PWM3
  Top 0.254: R5.1 36.49,37.08 33.66,37.08 33.15,37.59 31.37,37.59 29.21,39.75 14.22,39.75 12.95,38.48 12.95,36.7 11.43,35.18 11.43,33.66 U1.27
  Top 0.406: R5.1 R20.2
PWM4
  Top 0.254: 11.01,36.66 9.91,35.56 8.89,35.56 8.38,35.05 8.38,30.61 11.3,27.69 13.08,27.69 14.86,25.91 14.86,23.88 15.45,23.29 U1.62
  Top 0.305: 11.01,36.66 R7.1
  Top 0.406: R7.1 R21.2
PWR_CHECK  (via drill 0.6)
  Top 0.254: U1.20 14.95,32.09 v14.73,31.88 | v25.78,40.89 R31.1
  Top 0.406: R31.1 R30.2
  Bottom 0.254: v25.78,40.89 25.78,36.45 23.5,34.16 18.54,34.16 | 18.54,34.16 16.76,34.16 14.73,32.13 v14.73,31.88 | C35.2 18.38,34 18.54,34.16
RX-I
  Top 0.254: JBLUETOOTH.4 2.03,33.53 3.3,32.26 3.3,30.48 5.97,27.81 5.97,27.3 6.1,27.18 6.99,27.18 U1.42
TX-O
  Top 0.254: JBLUETOOTH.3 2.03,30.99 5.46,27.56 5.46,27.05 5.84,26.67 6.98,26.67 U1.43
VCC  (1 unrouted)
  Top 0: C8.2 46.74,9.4 46.61,9.53 | 46.61,9.53 46.61,9.02 46.74,8.89 | 46.61,9.53 47.24,9.02
  Top 0.254: 27.56,44.32 27.69,44.2 | C37.A 12.7,42.8 | C36.A 34.67,6.35
  Top 0.305: PAM3101_2.1 12.77,3.74 12.95,3.56 14.48,3.56 14.73,3.81 14.73,4.73 PAM3101_2.3
  Top 0.406: C7.2 1.02,9.31 M1+.P$1 | C1.A 27.94,5.33 27.94,6.1 | C11.A 20.32,42.93 20.32,42.42 | PWR2.1 12.45,45.72 JP6.P$1 | JP5.P$1 35.56,0.25 PWR1.1 | 27.56,45.72 27.56,44.32 R30.1
  Top 0.61: 12.77,4.83 PAM3101_2.1 12.74,4.83 C14.1 11.01,2.71 | 34.8,45.72 35.05,45.47 C2.1 33.27,43.78 PAM3101_1.1 | PAM3101_1.3 31.31,45.65 31.24,45.72
  Top 0.813: M4+.P$1 1.27,39.12 C10.2 | C9.2 47.24,39.2 M3+.P$1 | 11.18,2.54 11.01,2.71
  Top 1.27: M2+.P$1 46.74,8.89 45.72,8.89 45.72,7.62 arc90 40.64,2.54 PWR1.1 35.56,6.35 34.67,6.35 27.94,6.35 27.94,6.1 27.94,2.54 11.18,2.54 7.62,2.54 arc90 2.54,7.62 2.54,8.89 M1+.P$1 | M4+.P$1 2.54,39.37 2.54,40.64 arc90 7.62,45.72 PWR2.1 12.7,42.8 12.7,41.91 20.32,41.91 20.32,42.42 20.32,45.72 27.56,45.72 31.24,45.72 34.8,45.72 40.64,45.72 arc90 45.72,40.64 45.72,39.37 M3+.P$1

### Text on the board
tPlace: QuadroCopter | M4 | M3 | LED1 | LED2 | X | Y | SDA | SCL | Z | M2 | M1 | POWER | v0_1 by Librae
bPlace: LeafGrass